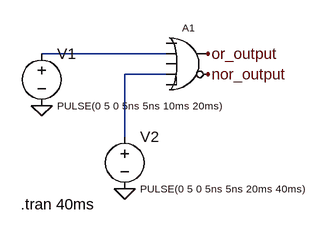
[diagram p0: schematic OR & NOR gate.asc]
OR & NOR gate.asc, the LTspice schematic file:
Version 4.1
SHEET 1 880 680
WIRE 160 112 -32 112
WIRE 160 144 96 144
WIRE 96 240 96 144
FLAG -32 192 0
FLAG 96 320 0
FLAG 224 112 or_output
FLAG 224 144 nor_output
SYMBOL voltage -32 96 R0
WINDOW 3 24 96 Left 1
WINDOW 123 0 0 Left 0
WINDOW 39 0 0 Left 0
SYMATTR InstName V1
SYMATTR Value PULSE(0 5 0 5ns 5ns 10ms 20ms)
SYMBOL voltage 96 224 R0
WINDOW 3 24 96 Left 1
WINDOW 123 0 0 Left 0
WINDOW 39 0 0 Left 0
SYMATTR InstName V2
SYMATTR Value PULSE(0 5 0 5ns 5ns 20ms 40ms)
SYMBOL Digital\\or 192 64 R0
WINDOW 0 -8 8 Left 1
SYMATTR InstName A1
TEXT -64 344 Left 2 !.tran 40ms

The netlist it stands for:
* OR & NOR gate.asc
V1 N001 0 PULSE(0 5 0 5ns 5ns 10ms 20ms)
V2 N002 0 PULSE(0 5 0 5ns 5ns 20ms 40ms)
A1 0 N001 0 N002 0 nor_output or_output 0 OR
.tran 40ms
.backanno
.end